# Altium schematic sheet ESC.SchDoc
size A; DocumentNumber: 1; SheetNumber: 1; SheetTotal: 6
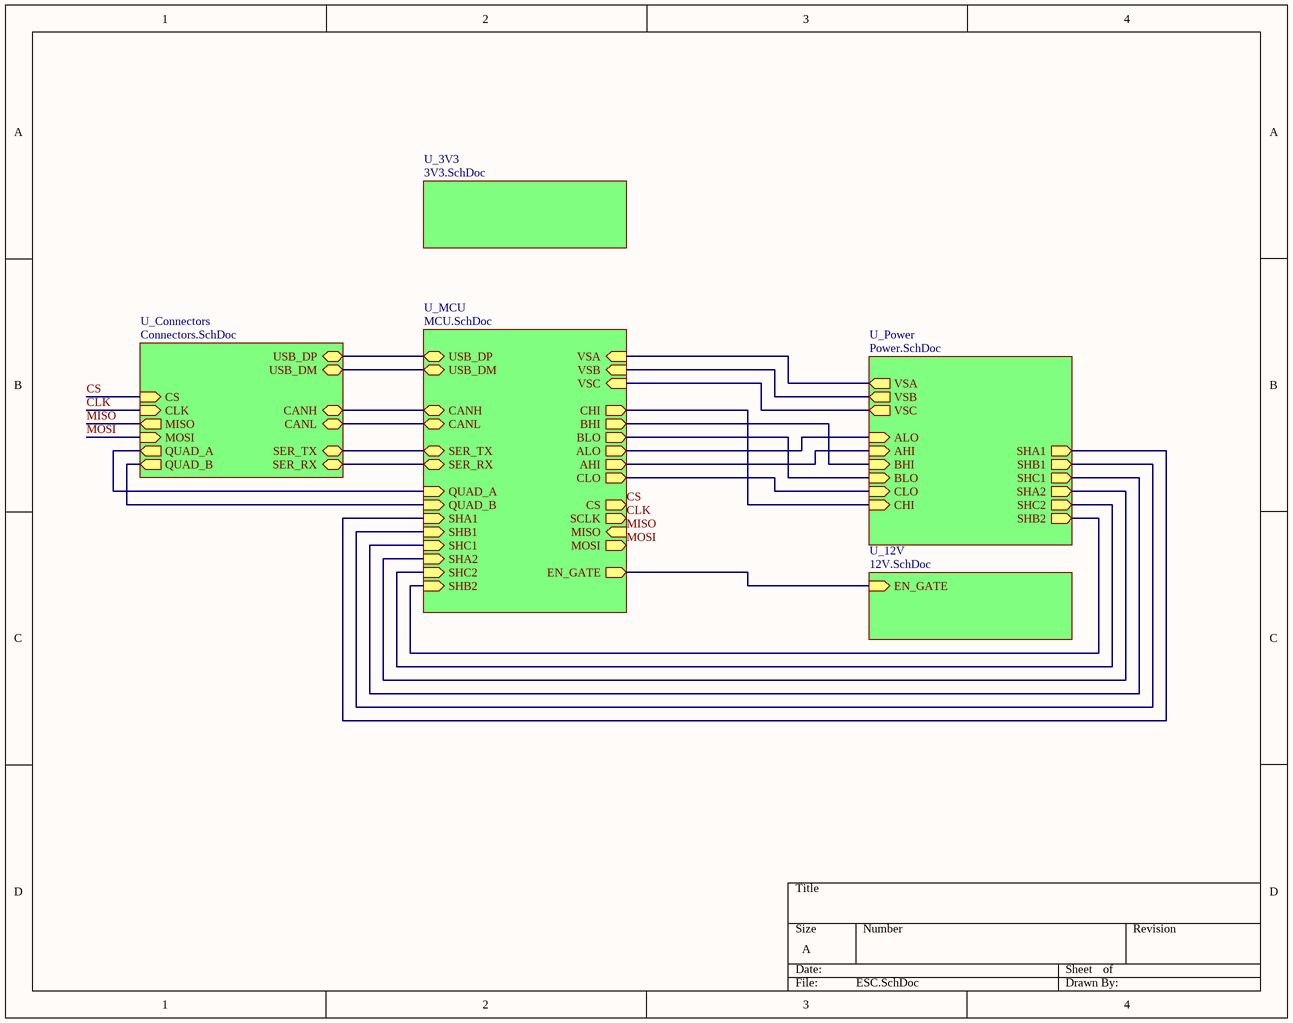
[diagram p0: ESC.SchDoc]

## Sub-sheets
U_3V3 = 3V3.SchDoc: no entries
U_12V = 12V.SchDoc: EN_GATE (in)
U_Connectors = Connectors.SchDoc: SER_RX (bidir), SER_TX (bidir), CS (in), CLK (in), MISO (out), MOSI (in), QUAD_A (out), QUAD_B (out), CANL (bidir), CANH (bidir), USB_DP (bidir), USB_DM (bidir)
U_MCU = MCU.SchDoc: CHI (out), BHI (out), BLO (out), ALO (out), AHI (out), CLO (out), MISO (in), SCLK (out), CS (out), QUAD_A (in), QUAD_B (in), SHC1 (in), SHB1 (in), USB_DP (bidir), MOSI (out), USB_DM (bidir), SHA1 (in), CANH (bidir), CANL (bidir), SER_TX (bidir), SER_RX (bidir), SHA2 (in), SHC2 (in), SHB2 (in), EN_GATE (out), VSC (in), VSB (in), VSA (in)
U_Power = Power.SchDoc: ALO (in), AHI (in), BHI (in), BLO (in), CLO (in), CHI (in), SHB1 (out), SHC1 (out), SHA1 (out), SHA2 (out), SHC2 (out), SHB2 (out), VSA (out), VSC (out), VSB (out)

## Nets
CLK: sheet U_MCU/SCLK, sheet U_Connectors/CLK
CS: sheet U_MCU/CS, sheet U_Connectors/CS
MISO: sheet U_MCU/MISO, sheet U_Connectors/MISO
MOSI: sheet U_MCU/MOSI, sheet U_Connectors/MOSI
(unnamed): sheet U_MCU/CHI, sheet U_Power/CHI
(unnamed): sheet U_MCU/BHI, sheet U_Power/BHI
(unnamed): sheet U_MCU/BLO, sheet U_Power/BLO
(unnamed): sheet U_MCU/ALO, sheet U_Power/ALO
(unnamed): sheet U_MCU/AHI, sheet U_Power/AHI
(unnamed): sheet U_MCU/CLO, sheet U_Power/CLO
(unnamed): sheet U_MCU/QUAD_A, sheet U_Connectors/QUAD_A
(unnamed): sheet U_MCU/QUAD_B, sheet U_Connectors/QUAD_B
(unnamed): sheet U_MCU/SHC1, sheet U_Power/SHC1
(unnamed): sheet U_MCU/SHB1, sheet U_Power/SHB1
(unnamed): sheet U_MCU/USB_DP, sheet U_Connectors/USB_DP
(unnamed): sheet U_MCU/USB_DM, sheet U_Connectors/USB_DM
(unnamed): sheet U_MCU/SHA1, sheet U_Power/SHA1
(unnamed): sheet U_MCU/CANH, sheet U_Connectors/CANH
(unnamed): sheet U_MCU/CANL, sheet U_Connectors/CANL
(unnamed): sheet U_MCU/SER_TX, sheet U_Connectors/SER_TX
(unnamed): sheet U_MCU/SER_RX, sheet U_Connectors/SER_RX
(unnamed): sheet U_MCU/SHA2, sheet U_Power/SHA2
(unnamed): sheet U_MCU/SHC2, sheet U_Power/SHC2
(unnamed): sheet U_MCU/SHB2, sheet U_Power/SHB2
(unnamed): sheet U_MCU/EN_GATE, sheet U_12V/EN_GATE
(unnamed): sheet U_MCU/VSC, sheet U_Power/VSC
(unnamed): sheet U_MCU/VSB, sheet U_Power/VSB
(unnamed): sheet U_MCU/VSA, sheet U_Power/VSA